# EAGLE schematic PIC32Circuit (EAGLE 7.5.0)
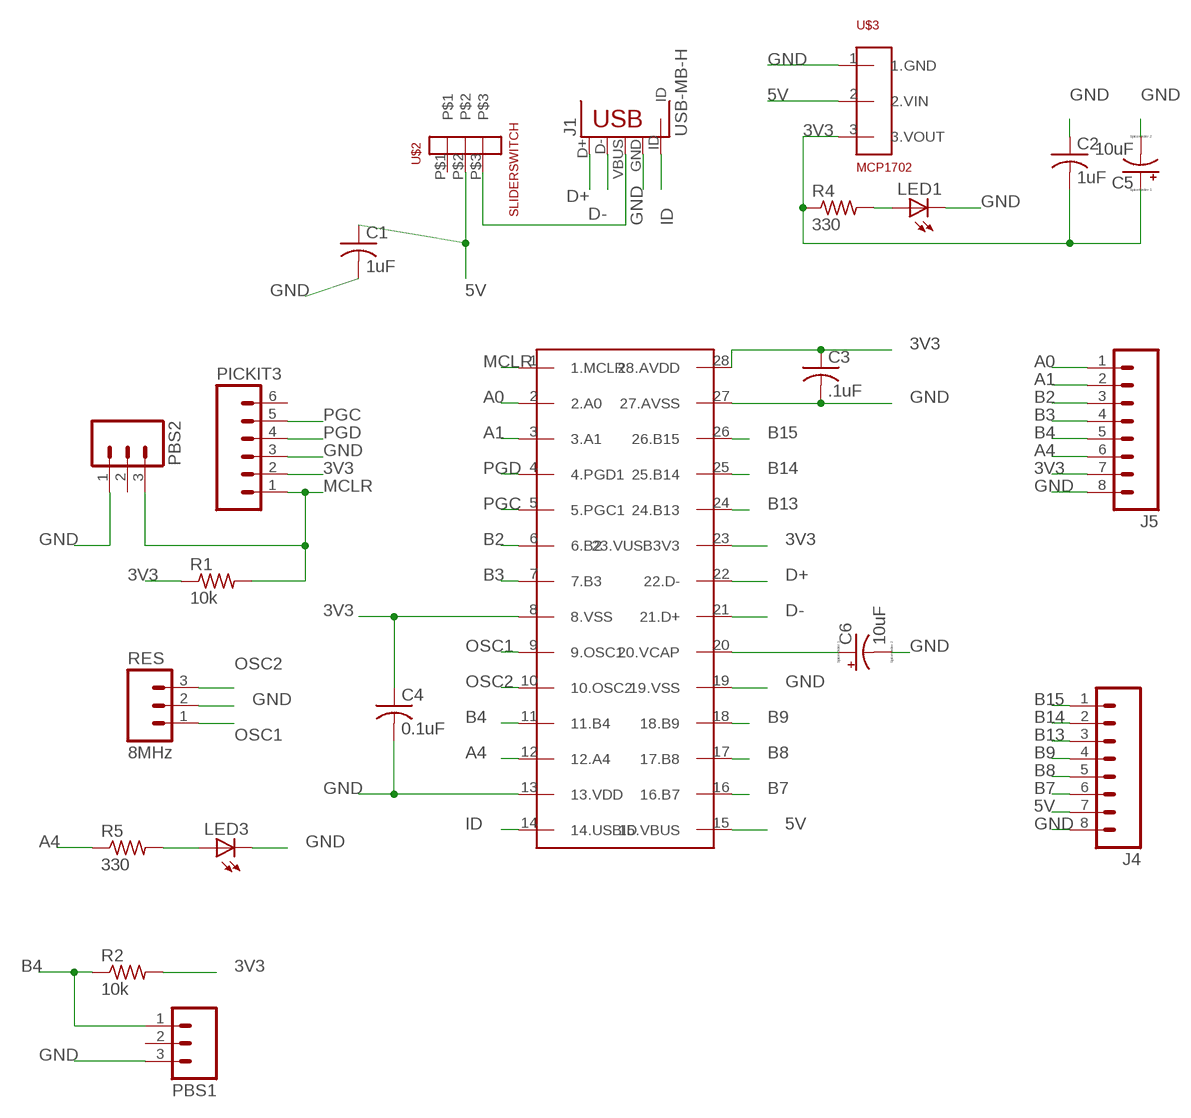
[diagram p0: schematic, sheet 1]

## Parts
C1  1uF  C-US025-024X044  [C025-024X044]
C2  1uF  C-US025-024X044  [C025-024X044]
C3  .1uF  C-US025-024X044  [C025-024X044]
C4  0.1uF  C-US025-024X044  [C025-024X044]
C5  10uF  CPOL-USTT2D4  [TT2D4]
C6  10uF  CPOL-USTT2D4  [TT2D4]
J1  USB-MB-H  [USB-MB-H]
J4  M08  [1X08_ROUND]
J5  M08  [1X08_ROUND]
LED1  LED3MM  [LED3MM]
LED3  LED3MM  [LED3MM]
PBS1  M03PTH  [1X03]
PBS2  M03PTH  [1X03]
PICKIT3  M06SILK_FEMALE_PTH  [1X06]
R1  10k  R-US_0207/10  [0207/10]
R2  10k  R-US_0207/10  [0207/10]
R4  330  R-US_0207/10  [0207/10]
R5  330  R-US_0207/10  [0207/10]
RES  8MHz  M03PTH  [1X03]
U$1  PIC32MX250F128B  [DIL28-3]
U$2  SLIDERSWITCH  [SLIDERSWITCH]
U$3  MCP1702  [TO92]

## Nets
3V3: C2.2 C3.1 C4.1 C5.+ J5.7 PICKIT3.2 R1.1 R2.2 R4.1 U$1.8(8.VSS) U$1.23(23.VUSB3V3) U$1.28(28.AVDD) U$3.3(3.VOUT)
5V: C1.1 J4.7 U$1.15(15.VBUS) U$2.P$2 U$3.2(2.VIN)
A0: J5.1 U$1.2(2.A0)
A1: J5.2 U$1.3(3.A1)
A4: J5.6 R5.1 U$1.12(12.A4)
B2: J5.3 U$1.6(6.B2)
B3: J5.4 U$1.7(7.B3)
B4: J5.5 PBS1.1 R2.1 U$1.11(11.B4)
B7: J4.6 U$1.16(16.B7)
B8: J4.5 U$1.17(17.B8)
B9: J4.4 U$1.18(18.B9)
B13: J4.3 U$1.24(24.B13)
B14: J4.2 U$1.25(25.B14)
B15: J4.1 U$1.26(26.B15)
D+: J1.D+ U$1.22(22.D-)
D-: J1.D- U$1.21(21.D+)
GND: C1.2 C2.1 C3.2 C4.2 C5.- C6.- J1.GND J4.8 J5.8 LED1.K(C) LED3.K(C) PBS1.3 PBS2.1 PICKIT3.3 RES.2 U$1.13(13.VDD) U$1.19(19.VSS) U$1.27(27.AVSS) U$3.1(1.GND)
ID: J1.ID U$1.14(14.USBID)
MCLR: PBS2.3 PICKIT3.1 R1.2 U$1.1(1.MCLR)
N$2: LED1.A R4.2
N$3: C6.+ U$1.20(20.VCAP)
N$4: J1.VBUS U$2.P$3
N$5: LED3.A R5.2
OSC1: RES.1 U$1.9(9.OSC1)
OSC2: RES.3 U$1.10(10.OSC2)
PGC: PICKIT3.5 U$1.5(5.PGC1)
PGD: PICKIT3.4 U$1.4(4.PGD1)
Unconnected: PBS1.2 PBS2.2 PICKIT3.6 U$2.P$1

## Library data of the parts
C1-C4 = PIC32:C-US: CAPACITOR, American symbol
C5 C6 = resistor:CPOL-US: POLARIZED CAPACITOR, American symbol
J1 = PIC32:USB: USB Connectors USB-B-PTH is fully proven SKU : PRT-00139/CONN-08278 USB-miniB is fully proven SKU : PRT-00587 USB-A-PCB is untested. USB-A-H is throughly reviewed, but untested. Spark Fun Electronics SKU : PRT-00437 USB-B-SMT is throughly reviewed, but untested. Needs silkscreen touching up. USB-A-S has not been used/tested USB-MB-H has not been used/tested USB-MICROB has been used. CONN-09505
J4 J5 = PIC32:M08: Header 8 Standard 8-pin 0.1" header. Use with straight break away headers (SKU : PRT-00116), right angle break away headers (PRT-00553), swiss pins (PRT-00743), machine pins (PRT-00117), and female headers (PRT-00115).; PROD_ID: CONN-08437
LED1 LED3 = led:LED: LED OSRAM: - CHIPLED LG R971, LG N971, LY N971, LG Q971, LY Q971, LO R971, LY R971 LH N974, LH R974 LS Q976, LO Q976, LY Q976 LO Q996 - Hyper CHIPLED LW Q18S LB Q993, LB Q99A, LB R99A - SideLED LS A670, LO A670, LY A670, LG A670, LP A670 LB A673, LV A673, LT A673, LW A673 LH A674 LY A675 LS A676, LA A676, LO A676, LY A676, LW A676 LS A679, LY A679, LG A679 - Hyper Micro SIDELED® LS Y876, LA Y876, LO Y876, LY Y876 LT Y87S - SmartLED LW L88C, LW L88S LB L89C, LB L89S, LG L890 LS L89K, LO L89K, LY L89K LS L896, LA L896, LO L896, LY L896 - TOPLED LS T670, LO T670, LY T670, LG T670, LP T670 LSG T670, LSP T670, LSY T670, LOP T670, LYG T670 LG T671, LOG T671, LSG T671 LB T673, LV T673, LT T673, LW T673 LH T674 LS T676, LA T676, LO T676, LY T676, LB T676, LH T676, LSB T676, LW T676 LB T67C, LV T67C, LT T67C, LS T67K, LO T67K, LY T67K, LW E67C LS E67B, LA E67B, LO E67B, LY E67B, LB E67C, LV E67C, LT E67C LW T67C LS T679, LY T679, LG T679 LS T770, LO T770, LY T770, LG T770, LP T770 LB T773, LV T773, LT T773, LW T773 LH T774 LS E675, LA E675, LY E675, LS T675 LS T776, LA T776, LO T776, LY T776, LB T776 LHGB T686 LT T68C, LB T68C - Hyper Mini TOPLED® LB M676 - Mini TOPLED Santana® LG M470 LS M47K, LO M47K, LY M47K Source: http://www.osram.convergy.de LUXEON: - LUMILED® LXK2-PW12-R00, LXK2-PW12-S00, LXK2-PW14-U00, LXK2-PW14-V00 LXK2-PM12-R00, LXK2-PM12-S00, LXK2-PM14-U00 LXK2-PE12-Q00, LXK2-PE12-R00, LXK2-PE12-S00, LXK2-PE14-T00, LXK2-PE14-U00 LXK2-PB12-K00, LXK2-PB12-L00, LXK2-PB12-M00, LXK2-PB14-N00, LXK2-PB14-P00, LXK2-PB14-Q00 LXK2-PR12-L00, LXK2-PR12-M00, LXK2-PR14-Q00, LXK2-PR14-R00 LXK2-PD12-Q00, LXK2-PD12-R00, LXK2-PD12-S00 LXK2-PH12-R00, LXK2-PH12-S00 LXK2-PL12-P00, LXK2-PL12-Q00, LXK2-PL12-R00 Source: www.luxeon.com KINGBRIGHT: KA-3528ASYC Source: www.kingbright.com
PBS1 PBS2 RES = PIC32:M03: Header 3 Standard 3-pin 0.1" header. Use with straight break away headers (SKU : PRT-00116), right angle break away headers (PRT-00553), swiss pins (PRT-00743), machine pins (PRT-00117), and female headers (PRT-00115). Molex polarized connector foot print use with SKU : PRT-08232 with associated crimp pins and housings.
PICKIT3 = PIC32:M06: Header 6 Standard 6-pin 0.1" header. Use with straight break away headers (SKU : PRT-00116), right angle break away headers (PRT-00553), swiss pins (PRT-00743), machine pins (PRT-00117), and female headers (PRT-00115). Molex polarized connector foot print use with SKU : PRT-08094 with associated crimp pins and housings. NOTES ON THE VARIANTS LOCK and LOCK_LONGPADS... This footprint was designed to help hold the alignment of a through-hole component (i.e. 6-pin header) while soldering it into place. You may notice that each hole has been shifted either up or down by 0.005 of an inch from it's more standard position (which is a perfectly straight line). This slight alteration caused the pins (the squares in the middle) to touch the edges of the holes. Because they are alternating, it causes a "brace" to hold the component in place. 0.005 has proven to be the perfect amount of "off-center" position when using our standard breakaway headers. Although looks a little odd when you look at the bare footprint, once you have a header in there, the alteration is very hard to notice. Also,if you push a header all the way into place, it is covered up entirely on the bottom side. This idea of altering the position of holes to aid alignment will be further integrated into the Sparkfun Library for other footprints. It can help hold any component with 3 or more connection pins.; PROD_ID: CONN-08437
R1 R2 R4 R5 = resistor:R-US_: RESISTOR, American symbol
U$1 = PIC32:PIC32MX250F128B
U$2 = PIC32:SLIDERSWITCH
U$3 = PIC32:MCP1702